# Altium schematic sheet power-optical.SchDoc
size A4
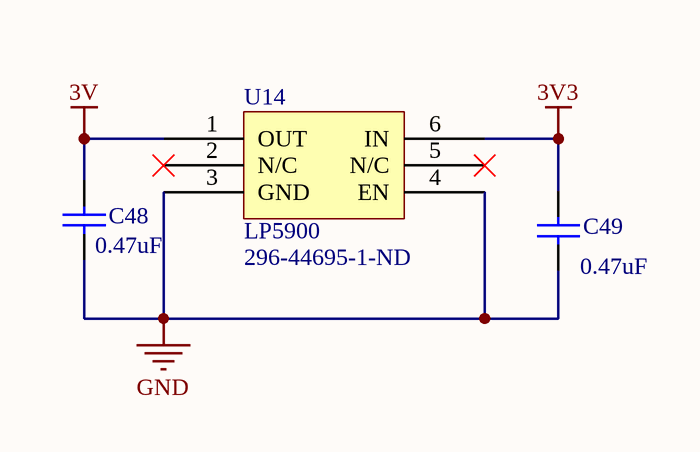
[diagram p0: power-optical.SchDoc]

## Parts
C48  value 0.47uF  [C1206]  (hidden comment: Cap Semi)
C49  value 0.47uF  [C1206]  (hidden comment: Cap Semi)
U14  LP5900  Supplier Part Number 1: 296-44695-1-ND

## Nets
3V: C48.2 U14.1(OUT)
3V3: C49.2 U14.6(IN)
GND: C48.1 C49.1 U14.3(GND) U14.4(EN)

Not connected (* = marked no-connect by the designer): U14 2(N/C)* 5(N/C)*

## Library data of the parts
C48 C49 = Cap Semi: Capacitor (Semiconductor SIM Model); Published: 8-Jun-2000; LatestRevisionDate: 29-May-2009; LatestRevisionNote: IPC-7351 Footprint Added.; PackageReference: C1206; Publisher: Altium Limited; PackageDescription: Chip Capacitor
U14 = LP5900: Low noise 3V low dropout regulator for analog and RF applications.; Supplier 1: Digi-Key